# EAGLE schematic SensorTemperatura (EAGLE 7.4.0)
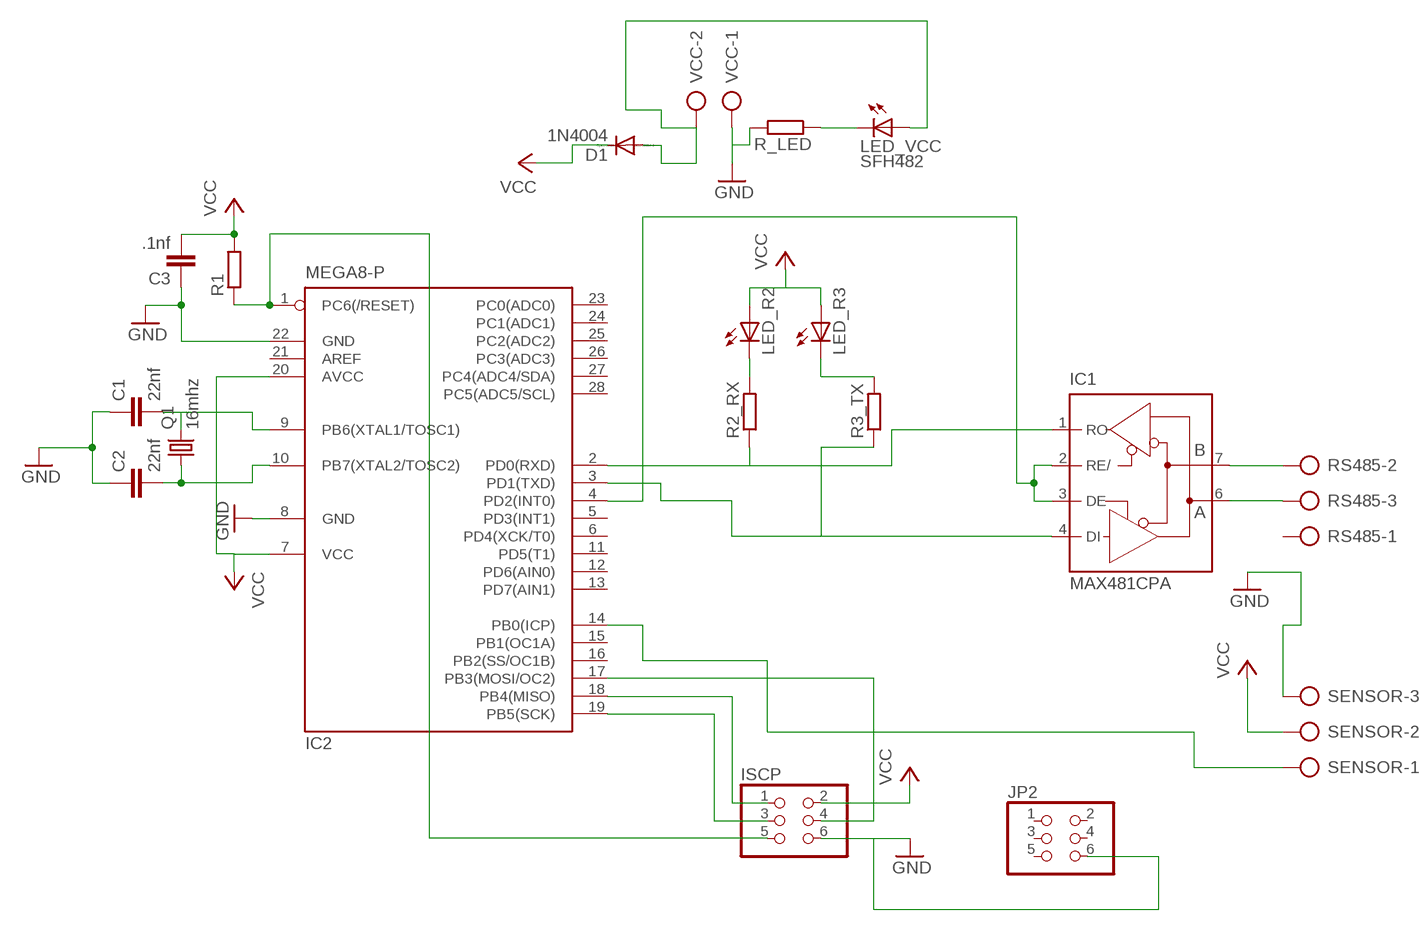
[diagram p0: schematic, sheet 1]

## Parts
C1  22nf  C-EU025-040X050  [C025-040X050]
C2  22nf  C-EU025-040X050  [C025-040X050]
C3  .1nf  C-EU025-040X050  [C025-040X050]
D1  1N4004  [DO41-10]
IC1  MAX481CPA  [DIL08]
IC2  MEGA8-P  [DIL28-3]
ISCP  PINHD-2X3  [2X03]
JP2  PINHD-2X3  [2X03]
LED_R2  SFH482  [SFH482]
LED_R3  SFH482  [SFH482]
LED_VCC  SFH482  [SFH482]
Q1  16mhz  CRYSTALHC49U-V  [HC49U-V]
R1  R-EU_0204/7  [0204/7]
R2_RX  R-EU_0204/7  [0204/7]
R3_TX  R-EU_0204/7  [0204/7]
R_LED  R-EU_0204/7  [0204/7]
RS485  AK500/3  [AK500/3]
SENSOR  AK500/3  [AK500/3]
VCC  AK500/2  [AK500/2]

## Nets
GND: C1.1 C2.1 C3.1 IC2.8(GND) IC2.22(GND) ISCP.6 JP2.6 R_LED.2 SENSOR.3 VCC.1
N$1: IC1.2(RE/) IC1.3(DE) IC2.4(PD2(INT0))
N$2: IC2.18(PB4(MISO)) ISCP.1
N$3: IC1.1(RO) IC2.2(PD0(RXD)) R2_RX.1
N$4: LED_R2.K(C) R2_RX.2
N$5: LED_R3.K(C) R3_TX.2
N$6: IC1.4(DI) IC2.3(PD1(TXD)) R3_TX.1
N$7: IC1.6(A) RS485.3
N$8: IC1.7(B) RS485.2
N$9: IC2.19(PB5(SCK)) ISCP.3
N$10: IC2.14(PB0(ICP)) SENSOR.1
N$11: C1.2 IC2.9(PB6(XTAL1/TOSC1)) Q1.2
N$12: C2.2 IC2.10(PB7(XTAL2/TOSC2)) Q1.1
N$13: IC2.1(PC6(/RESET)) ISCP.5 R1.1
N$14: IC2.17(PB3(MOSI/OC2)) ISCP.4
N$15: D1.A LED_VCC.A VCC.2
N$17: LED_VCC.K(C) R_LED.1
VCC: C3.2 D1.C IC2.7(VCC) IC2.20(AVCC) ISCP.2 LED_R2.A LED_R3.A R1.2 SENSOR.2
Unconnected: IC2.5(PD3(INT1)) IC2.6(PD4(XCK/T0)) IC2.11(PD5(T1)) IC2.12(PD6(AIN0)) IC2.13(PD7(AIN1)) IC2.15(PB1(OC1A)) IC2.16(PB2(SS/OC1B)) IC2.21(AREF) IC2.23(PC0(ADC0)) IC2.24(PC1(ADC1)) IC2.25(PC2(ADC2)) IC2.26(PC3(ADC3)) IC2.27(PC4(ADC4/SDA)) IC2.28(PC5(ADC5/SCL)) JP2.1 JP2.2 JP2.3 JP2.4 JP2.5 RS485.1

## Power pins joined to a net without a drawn wire
GND: IC1.5(GND)
VCC: IC1.8(VCC)

## Library data of the parts
C1-C3 = rcl:C-EU: CAPACITOR, European symbol
D1 = diode:1N4004: DIODE general purpose rectifier, 1 A
IC1 = maxim:MAX481CPA: RS485 TRANSEIVER; MPN: MAX481CPA+; OC_FARNELL: unknown; OC_NEWARK: 99K3445
IC2 = atmel:MEGA8-P: MICROCONTROLLER 8 Kbytes FLASH, 1 kbytes SRAM, 512 bytes EEPROM, USART, 4-channel 10 bit ADC, 2-channel 8 bit ADC Pin compatible with Atmega48, ATMega88, ATMega168 Source: avr.lbr; OC_FARNELL: unknown; OC_NEWARK: unknown
ISCP JP2 = pinhead:PINHD-2X3: PIN HEADER
LED_R2 LED_R3 LED_VCC = led:SFH482: IR LED infrared emitting diode, Infineon
Q1 = crystal:CRYSTAL: CRYSTAL; OC_FARNELL: 1666969; OC_NEWARK: unknown
R1 R2_RX R3_TX R_LED = rcl:R-EU_: RESISTOR, European symbol
RS485 SENSOR = con-ptr500:AK500/3: CONNECTOR; OC_FARNELL: unknown; OC_NEWARK: unknown
VCC = con-ptr500:AK500/2: CONNECTOR; OC_FARNELL: unknown; OC_NEWARK: unknown